# EAGLE design untitled (EAGLE 9.5.2)

## Sheet 1 of 3
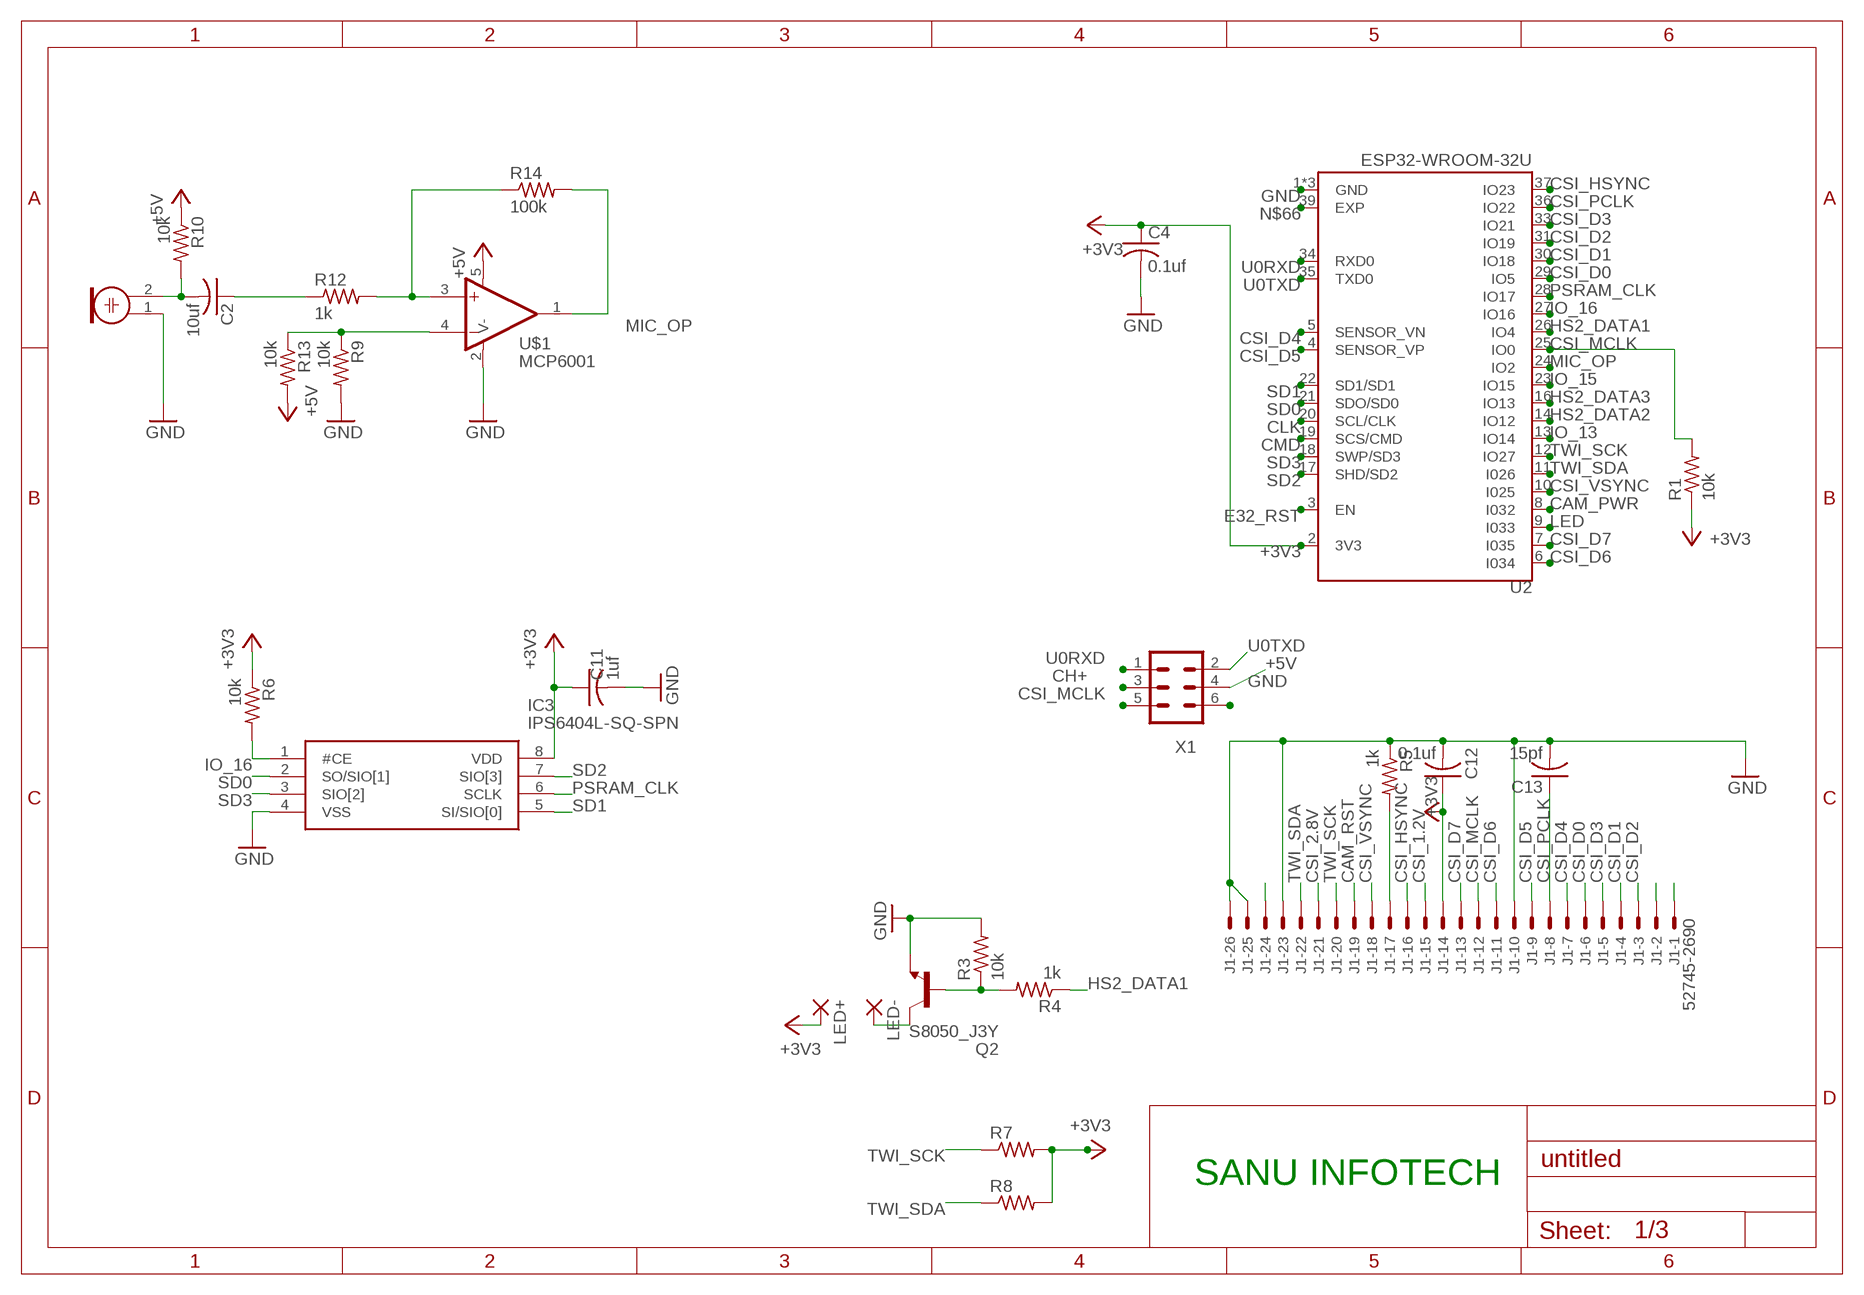
[diagram p0: schematic, sheet 1]

### Parts
C2  10uf  C-USC0805  [C0805]
C4  0.1uf  C-USC0805  [C0805]
C11  1uf  C-USC0805  [C0805]
C12  0.1uf  C-USC0805  [C0805]
C13  15pf  C-USC0805  [C0805]
IC3  IPS6404L-SQ-SPN  [SOIC127P600X175-8N]
J1  52745-2690  [52745-2690]
LED+  SMD2  [SMD1,27-2,54]
LED-  SMD2  [SMD1,27-2,54]
M1  ELECTRET_MICROPHON-F6035AP  [F6035AP]
Q2  S8050_J3Y  BCX70SMD  [SOT23]
R1  10k  R-US_R0805  [R0805]
R3  10k  R-US_R0805  [R0805]
R4  1k  R-US_R0805  [R0805]
R5  1k  R-US_R0805  [R0805]
R6  10k  R-US_R0805  [R0805]
R7  R-US_R0805  [R0805]
R8  R-US_R0805  [R0805]
R9  10k  R-US_R0805  [R0805]
R10  10k  R-US_R0805  [R0805]
R12  1k  R-US_R0805  [R0805]
R13  10k  R-US_R0805  [R0805]
R14  100k  R-US_R0805  [R0805]
U2  ESP32-WROOM-32U  [XCVR_ESP32-WROOM-32U]
U$1  MCP6001  [SOT23-5]
X1  MA03-2  [MA03-2]

### Nets
+3V3: C4.1 C11.1 C12.1 IC3.8(VDD) J1.14 LED+.1(P) R1.1 R6.1 R7.2 R8.2 U2.2(3V3) ; also sheet 3
+5V: R10.1 R13.2 U$1.5(V+) X1.4 ; also sheet 2,3
CAM_PWR: U2.8(I032) ; also sheet 3
CAM_RST: J1.19
CH+: X1.3 ; also sheet 3
CLK: U2.20(SCL/CLK)
CMD: U2.19(SCS/CMD)
CSI_1.2V: J1.15 ; also sheet 3
CSI_2.8V: J1.21 ; also sheet 3
CSI_D0: J1.6 U2.29(IO5)
CSI_D1: J1.4 U2.30(IO18)
CSI_D2: J1.3 U2.31(IO19)
CSI_D3: J1.5 U2.33(IO21)
CSI_D4: J1.7 U2.5(SENSOR_VN)
CSI_D5: J1.9 U2.4(SENSOR_VP)
CSI_D6: J1.11 U2.6(I034)
CSI_D7: J1.13 U2.7(I035)
CSI_HSYNC: J1.16 U2.37(IO23)
CSI_MCLK: J1.12 R1.2 U2.25(IO0) X1.5
CSI_PCLK: C13.1 J1.8 U2.36(IO22)
CSI_VSYNC: J1.18 U2.10(I025)
E32_RST: U2.3(EN)
GND: C4.2 C11.2 C12.2 C13.2 IC3.4(VSS) J1.10 J1.23 J1.25 J1.26 M1.1 Q2.2(E) R3.2 R5.1 R9.2 U2.1(GND) U2.15(GND) U2.38(GND) U$1.2(V-) X1.6 ; also sheet 2,3
HS2_DATA1: R4.1 U2.26(IO4)
HS2_DATA2: U2.14(IO12) ; also sheet 2
HS2_DATA3: U2.16(IO13) ; also sheet 2
IO_13: U2.13(IO14)
IO_15: U2.23(IO15)
IO_16: IC3.1(#CE) R6.2 U2.27(IO16)
LED: U2.9(I033)
MIC_OP: R14.2 U2.24(IO2) U$1.1(OUT)
N$6: J1.24
N$9: Q2.1(B) R3.1 R4.2
N$11: LED-.1(P) Q2.3(C)
N$13: J1.17 R5.2
N$23: C2.2 M1.2 R10.2
N$24: C2.1 R12.1
N$25: R12.2 R14.1 U$1.3(+IN)
N$27: R9.1 R13.1 U$1.4(-IN)
N$28: J1.2
N$29: J1.1
N$66: U2.39(EXP)
PSRAM_CLK: IC3.6(SCLK) U2.28(IO17)
SD0: IC3.2(SO/SIO[1]) U2.21(SDO/SD0)
SD1: IC3.5(SI/SIO[0]) U2.22(SD1/SD1)
SD2: IC3.7(SIO[3]) U2.17(SHD/SD2)
SD3: IC3.3(SIO[2]) U2.18(SWP/SD3)
TWI_SCK: J1.20 R7.1 U2.12(IO27)
TWI_SDA: J1.22 R8.1 U2.11(I026)
U0RXD: U2.34(RXD0) X1.1
U0TXD: U2.35(TXD0) X1.2

### Notes on the sheet
- SANU INFOTECH

## Sheet 2 of 3
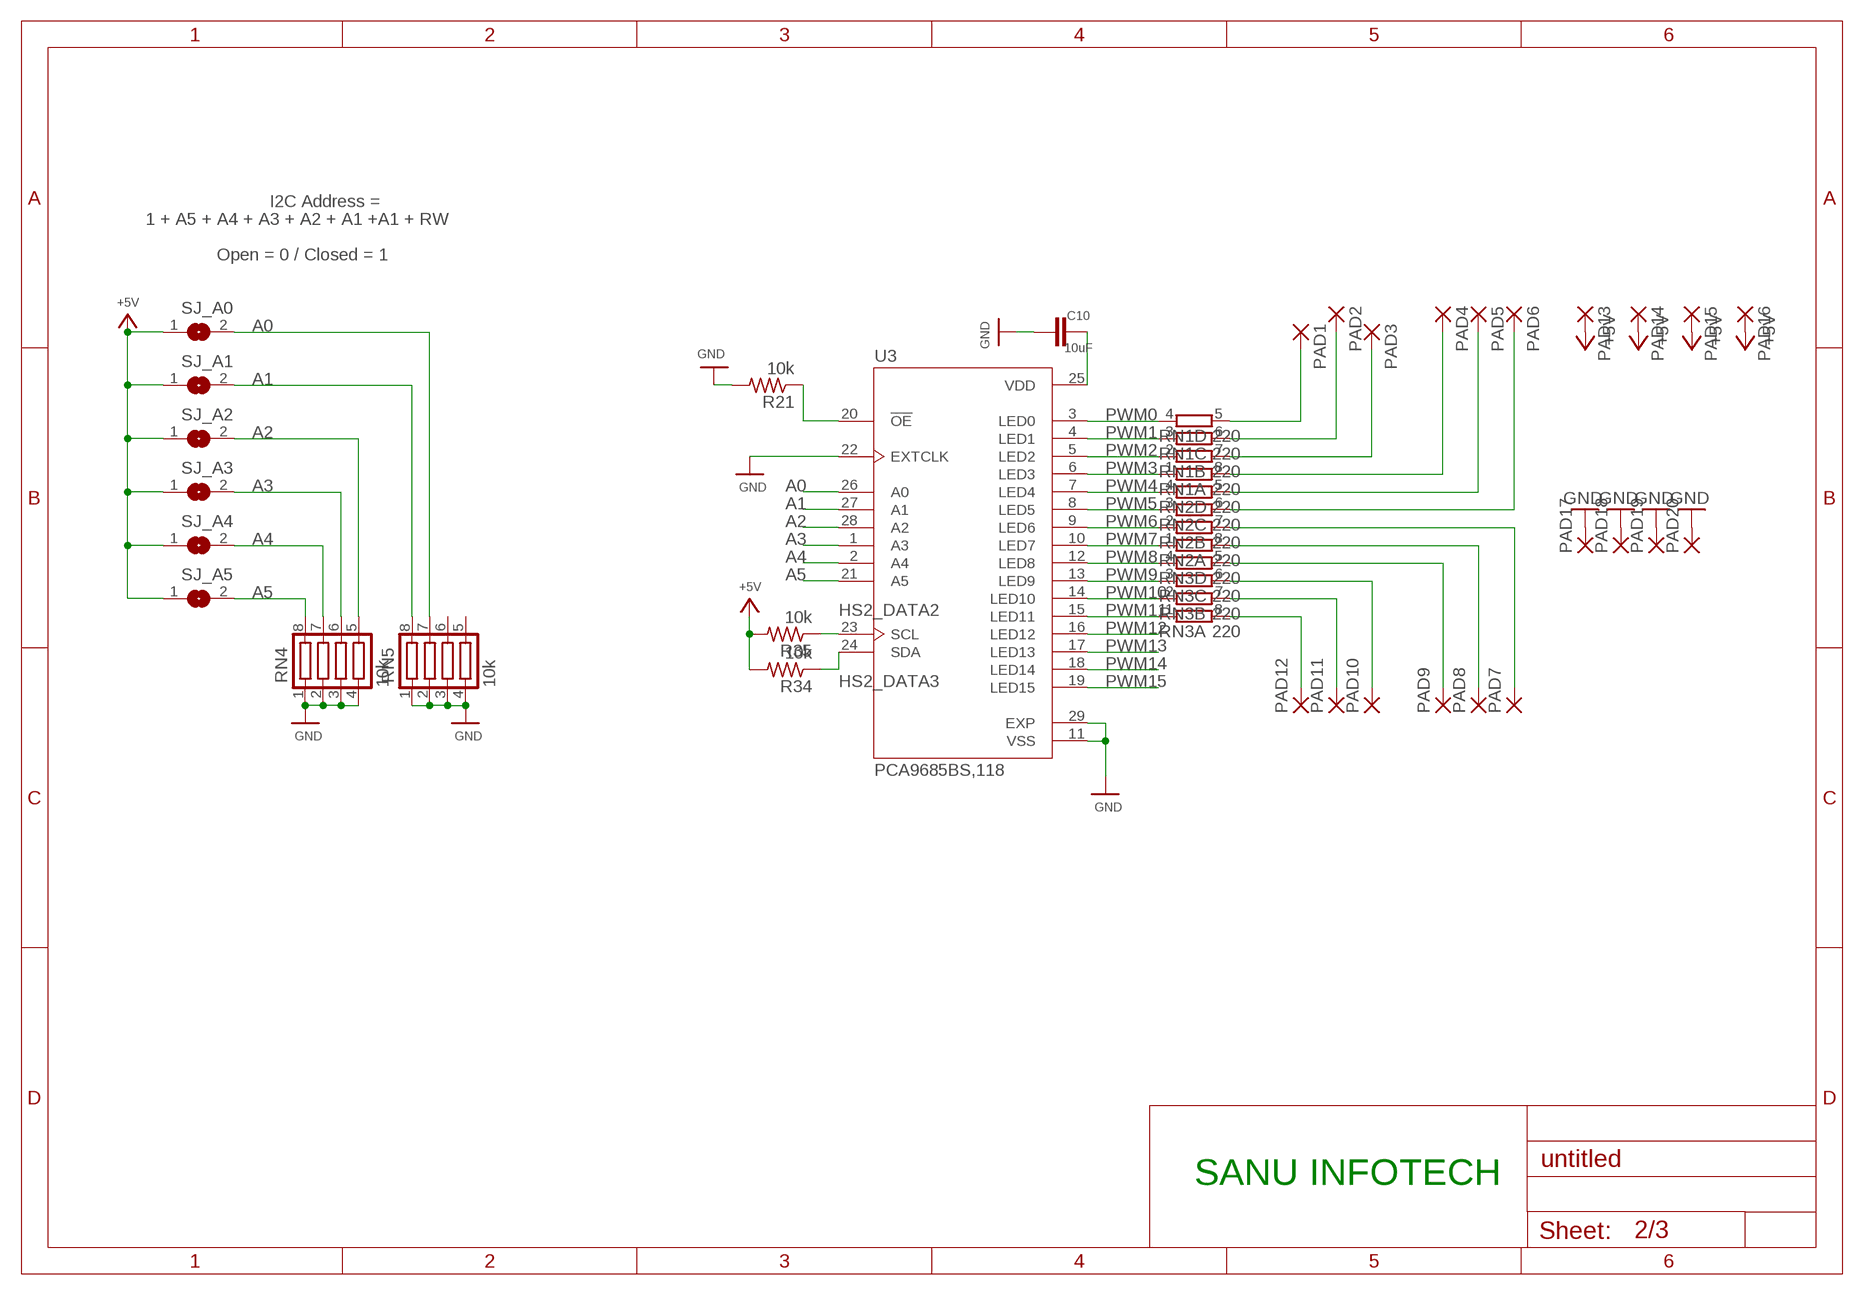
[diagram p1: schematic, sheet 2]

### Parts
C10  10uF  C-EUC0805  [C0805]
PAD1  1,6/0,8  [1,6/0,8]
PAD2  1,6/0,8  [1,6/0,8]
PAD3  1,6/0,8  [1,6/0,8]
PAD4  1,6/0,8  [1,6/0,8]
PAD5  1,6/0,8  [1,6/0,8]
PAD6  1,6/0,8  [1,6/0,8]
PAD7  1,6/0,8  [1,6/0,8]
PAD8  1,6/0,8  [1,6/0,8]
PAD9  1,6/0,8  [1,6/0,8]
PAD10  1,6/0,8  [1,6/0,8]
PAD11  1,6/0,8  [1,6/0,8]
PAD12  1,6/0,8  [1,6/0,8]
PAD13  1,6/0,8  [1,6/0,8]
PAD14  1,6/0,8  [1,6/0,8]
PAD15  1,6/0,8  [1,6/0,8]
PAD16  1,6/0,8  [1,6/0,8]
PAD17  1,6/0,8  [1,6/0,8]
PAD18  1,6/0,8  [1,6/0,8]
PAD19  1,6/0,8  [1,6/0,8]
PAD20  1,6/0,8  [1,6/0,8]
R21  10k  R-US_R0805  [R0805]
R34  10k  R-US_R0805  [R0805]
R35  10k  R-US_R0805  [R0805]
RN1  220  4R-N0603-ARV  [0603-ARV]
RN2  220  4R-N0603-ARV  [0603-ARV]
RN3  220  4R-N0603-ARV  [0603-ARV]
RN4  10k  CTS742C083  [CTS742C083]
RN5  10k  CTS742C083  [CTS742C083]
SJ_A0  SJ  [SJ]
SJ_A1  SJ  [SJ]
SJ_A2  SJ  [SJ]
SJ_A3  SJ  [SJ]
SJ_A4  SJ  [SJ]
SJ_A5  SJ  [SJ]
U3  PCA9685BS,118  [QFN65P600X600X100-29N]

### Nets
+5V: PAD13.1(P) PAD14.1(P) PAD15.1(P) PAD16.1(P) R34.2 R35.2 SJ_A0.1 SJ_A1.1 SJ_A2.1 SJ_A3.1 SJ_A4.1 SJ_A5.1 ; also sheet 1,3
A0: RN5.7 SJ_A0.2 U3.26(A0)
A1: RN5.8 SJ_A1.2 U3.27(A1)
A2: RN4.5 SJ_A2.2 U3.28(A2)
A3: RN4.6 SJ_A3.2 U3.1(A3)
A4: RN4.7 SJ_A4.2 U3.2(A4)
A5: RN4.8 SJ_A5.2 U3.21(A5)
GND: C10.2 PAD17.1(P) PAD18.1(P) PAD19.1(P) PAD20.1(P) R21.2 RN4.1 RN4.2 RN4.3 RN4.4 U3.11(VSS) U3.22(EXTCLK) U3.29(EXP) ; also sheet 1,3
HS2_DATA2: R35.1 U3.23(SCL) ; also sheet 1
HS2_DATA3: R34.1 U3.24(SDA) ; also sheet 1
N$1: PAD1.1(P) RN1.5
N$3: PAD2.1(P) RN1.6
N$5: PAD3.1(P) RN1.7
N$7: PAD4.1(P) RN1.8
N$10: PAD5.1(P) RN2.5
N$12: PAD6.1(P) RN2.6
N$14: PAD7.1(P) RN2.7
N$15: PAD8.1(P) RN2.8
N$16: PAD9.1(P) RN3.5
N$17: PAD10.1(P) RN3.6
N$18: PAD11.1(P) RN3.7
N$19: PAD12.1(P) RN3.8
N$21: RN5.1 RN5.2 RN5.3 RN5.4 ; supply symbol labelled GND
N$22: C10.1 U3.25(VDD)
OE: R21.1 U3.20(!OE)
PWM0: RN1.4 U3.3(LED0)
PWM1: RN1.3 U3.4(LED1)
PWM2: RN1.2 U3.5(LED2)
PWM3: RN1.1 U3.6(LED3)
PWM4: RN2.4 U3.7(LED4)
PWM5: RN2.3 U3.8(LED5)
PWM6: RN2.2 U3.9(LED6)
PWM7: RN2.1 U3.10(LED7)
PWM8: RN3.4 U3.12(LED8)
PWM9: RN3.3 U3.13(LED9)
PWM10: RN3.2 U3.14(LED10)
PWM11: RN3.1 U3.15(LED11)
PWM12: U3.16(LED12)
PWM13: U3.17(LED13)
PWM14: U3.18(LED14)
PWM15: U3.19(LED15)
Unconnected: RN5.5 RN5.6

### Notes on the sheet
- I2C Address =
- 1 + A5 + A4 + A3 + A2 + A1 +A1 + RW
- Open = 0 / Closed = 1
- SANU INFOTECH

## Sheet 3 of 3
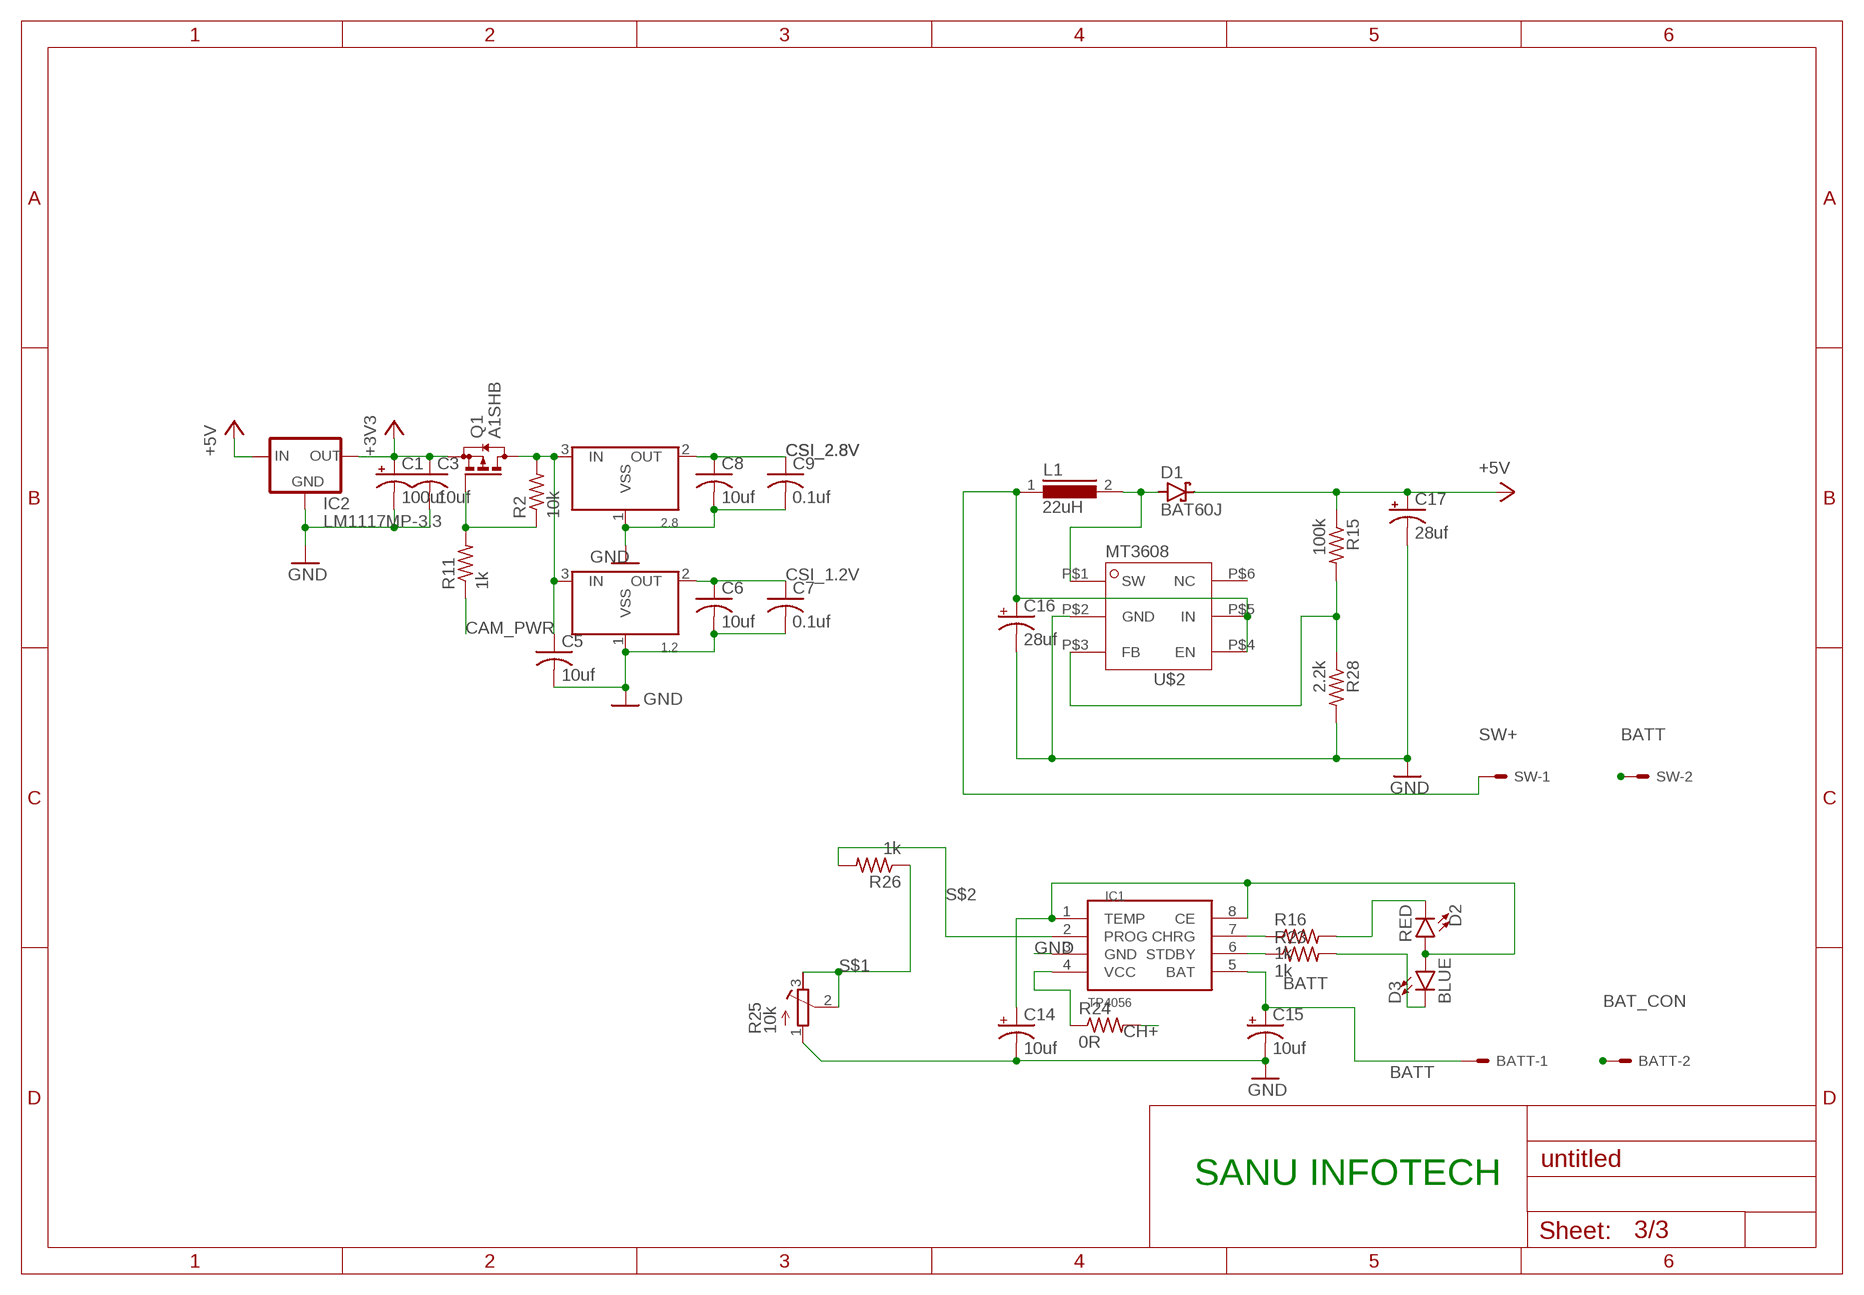
[diagram p2: schematic, sheet 3]

### Parts
1.2  XC6206SOT-23  [XC6206_SOT-23]
2.8  XC6206SOT-23  [XC6206_SOT-23]
BATT  332-02  [332-02]
C1  100uf  CPOL-USB/3528-21R  [B/3528-21R]
C3  10uf  C-USC0805  [C0805]
C5  10uf  C-USC0805  [C0805]
C6  10uf  C-USC0805  [C0805]
C7  0.1uf  C-USC0805  [C0805]
C8  10uf  C-USC0805  [C0805]
C9  0.1uf  C-USC0805  [C0805]
C14  10uf  CPOL-USB/3528-21W  [B/3528-21W]
C15  10uf  CPOL-USB/3528-21W  [B/3528-21W]
C16  28uf  CPOL-US153CLV-0405  [153CLV-0405]
C17  28uf  CPOL-US153CLV-0405  [153CLV-0405]
D1  BAT60J  [SOD323_ST]
D2  RED  LED-RED0603  [LED-0603]
D3  BLUE  LED-BLUE0603  [LED-0603]
IC1  TP4056  [SOP-8]
IC2  LM1117MP-3.3  [SOT223]
L1  22uH  DR74  [DR74]
Q1  A1SHB  BSS84  [SOT23]
R2  10k  R-US_R0805  [R0805]
R11  1k  R-US_R0805  [R0805]
R15  100k  R-US_M0805  [M0805]
R16  1k  R-US_M0805  [M0805]
R23  1k  R-US_M0805  [M0805]
R24  0R  R-US_M0805  [M0805]
R25  10k  R-TRIMM4G/J  [RTRIM4G/J]
R26  1k  R-US_M0805  [M0805]
R28  2.2k  R-US_M0805  [M0805]
SW  332-02  [332-02]
U$2  MT3608SOT23-6  [SOT23-6]

### Nets
+3V3: C1.+ C3.1 IC2.2(OUT) IC2.4(OUT) Q1.2(S) ; also sheet 1
+5V: C17.+ D1.C IC2.3(IN) R15.1 ; also sheet 1,2
BAT_CON: BATT.2
BATT: BATT.1 C15.+ IC1.5(BAT) SW.2
CAM_PWR: R11.1 ; also sheet 1
CH+: R24.2 ; also sheet 1
CSI_1.2V: 1.2.2(OUT) C6.1 C7.1 ; also sheet 1
CSI_2.8V: 2.8.2(OUT) C8.1 C9.1 ; also sheet 1
GND: 1.2.1(VSS) 2.8.1(VSS) C1.- C3.2 C5.2 C6.2 C7.2 C8.2 C9.2 C14.- C15.- C16.- C17.- IC1.3(GND) IC2.1(GND) R25.1(A) R28.2 U$2.P$2(GND) ; also sheet 1,2
N$2: 1.2.3(IN) 2.8.3(IN) C5.1 Q1.3(D) R2.2
N$8: Q1.1(G) R2.1 R11.2
N$20: C14.+ D2.A D3.A IC1.1(TEMP) IC1.8(CE)
N$26: R15.2 R28.1 U$2.P$3(FB)
N$31: D2.C R16.2
N$32: IC1.4(VCC) R24.1
N$33: IC1.6(STDBY) R23.1
N$34: IC1.7(CHRG) R16.1
N$35: D3.C R23.2
N$36: D1.A L1.2 U$2.P$1(SW)
S$1: R25.2(S) R25.3(E) R26.1
S$2: IC1.2(PROG) R26.2
SW+: C16.+ L1.1 SW.1 U$2.P$4(EN) U$2.P$5(IN)
Unconnected: U$2.P$6(NC)

### Notes on the sheet
- SANU INFOTECH

## Library data of the parts
1.2 2.8 = Voltage Regulator:XC6206: XC6206P , linear regulator. Producted by TOREX.Co Store Information: EXCEL device corporation http://www.excel-d.com/access/index.html
BATT SW = con-garry:332-02: 2 Pin - 2mm Dual Row Source: www.mpe-connector.de / garry_shortform_2012.pdf
C1 C14-C17 = rcl:CPOL-US: POLARIZED CAPACITOR, American symbol; SPICEPREFIX: C
C2-C9 C11-C13 = rcl:C-US: CAPACITOR, American symbol; SPICEPREFIX: C
C10 = rcl:C-EU: CAPACITOR, European symbol; SPICEPREFIX: C
D1 = diode:BAT60J: Schottky barrier diode Source: www.st.com, BAT60J.pdf
D2 = SparkFun-LED:LED-RED: Red SMD LED Used in manufacturing of most products at SparkFun Packages: 0603 - SMD 0603 package [Product Link] <http://docs.avagotech.com/docs/AV02-0551EN> 0603 SMART - SMD 0603 SMART package ( more efficient and expensive)[Product Link] <http://www.osram-os.com/Graphics/XPic2/00077099_0.pdf> 1206 - SMD1206 package [Product Link] <https://www.sparkfun.com/datasheets/DevTools/LilyPad/Q150OVS4.pdff> SparkFun Products: Pro Mini 328 -5V <https://www.sparkfun.com/products/821> RedBoard <https://www.sparkfun.com/products/12757> IOIO-OTG <https://www.sparkfun.com/products/13613>; PROD_ID: DIO-00819
D3 = SparkFun-LED:LED-BLUE: Blue SMD LED Used in manufacturing of various products at SparkFun Packages: 0603 - SMD 0603 package [Product Link] <http://www.digikey.com/product-detail/en/SMLE12BC7TT86/511-1589-2-ND/1641808> 1206 - SMD1206 package [Product Link] <http://www.digikey.com/product-detail/en/lite-on-inc/LTST-C150TBKT/160-1643-1-ND/573584> SparkFun Products: ESP8266 Thing-Dev Board <https://www.sparkfun.com/products/13711> RedBoard <https://www.sparkfun.com/products/12757>; PROD_ID: DIO-08575
IC1 = TP4056:TP4056
IC2 = lm1117_10:LM1117?-*: 800mA Low-Dropout Linear Regulator Source: http://www.ti.com/lit/ds/symlink/lm1117-n.pdf; MF: Texas Instruments; MPN: LM1117MP-3.3; OC_FARNELL: 9778195; OC_NEWARK: 28X3416
IC3 = IPS6404L-SQ-SPN:IPS6404L-SQ-SPN: int Source: Datasheet <https://github.com/Edragon/Datasheet/blob/master/IPUS/IPUS 64Mbit.pdf>; DESCRIPTION: int; HEIGHT: 1.75mm; MANUFACTURER_NAME: Electrodragon; MANUFACTURER_PART_NUMBER: IPS6404L-SQ-SPN
J1 = con-molex:52745-2690: FFC/FPC-to-Board 0.50mm (.020") SMT Top Contact Right Angle, ZIF, Style Receptacle 52745 / 52435 Source: http://www.molex.com/product/ffc/52745.html; MF: MOLEX; OC_FARNELL: unknown; OC_NEWARK: unknown
L1 = inductors:DR74: High Power Density, High Efficiency, Shielded Inductors Source: coiltronics_dr_series.pdf; SPICEPREFIX: L
LED+ LED- = wirepad:SMD2: SMD PAD
M1 = microphon:ELECTRET_MICROPHON-: Electret Condenser Microphone
PAD1-PAD20 = wirepad:1,6/0,8: THROUGH-HOLE PAD
Q1 = transistor-small-signal:BSS84: P-CHANNEL MOS FET
Q2 = transistor-npn:BCX70*: NPN Transistor
R1-R16 R21 R23 R24 R26 R28 R34 R35 = rcl:R-US_: RESISTOR, American symbol; SPICEPREFIX: R
R25 = rcl:R-TRIMM: Trimm resistor; SPICEMODEL: X; SPICEPREFIXL: POT
RN1-RN3 = resistor-dil:4R-N: Array Chip Resistor Source: RS Component / Phycomp; OC_FARNELL: unknown; OC_NEWARK: unknown
RN4 RN5 = resistor-net:CTS742C083: Chip Resistor Array 4 Single Resistor Source: http://www.ctscorp.com/components/Datasheets/CTSChipArrayDs.pdf; OC_FARNELL: unknown; OC_NEWARK: unknown
SJ_A0 SJ_A1-SJ_A5 = jumper:SJ: SMD solder JUMPER
U2 = ESP32-WROOM-32U:ESP32-WROOM-32U: Wi-Fi/BT BLE Module ESP32-D0WD SPI Flash UART U.FL Conn.; AVAILABILITY: Unavailable; DESCRIPTION: Bluetooth, WiFi 802.11b/g/n, Bluetooth v4.2 + EDR, Class 1, 2 and 3 Transceiver Module 2.4GHz ~ 2.5GHz Antenna Not Included, U.FL Surface Mount; MF: Espressif Systems; MP: ESP32-WROOM-32U; PACKAGE: Module Espressif Systems; PRICE: None
U3 = PCA9685BS_118:PCA9685BS,118: PCA9685 - 16-channel, 12-bit PWM Fm+ I2C-bus LED controller; AVAILABILITY: Unavailable; DESCRIPTION: LED Driver IC 16 Output Linear PWM Dimming 25mA 28-HVQFN _6x6_; MF: NXP USA; MP: PCA9685BS,118; PACKAGE: HVQFN-28 NXP Semiconductors; PRICE: None
U$1 = MCP6001:MCP6001: General Op Amp 1.8V min supply 1MHz (6V/us); AVAILABILITY: Unavailable; DESCRIPTION: General Purpose Amplifier 1 Circuit Rail-to-Rail SOT-23-5; MF: Universal Power Group; MP: MCP 6001; PACKAGE: SOT-753 Universal Power Group; PRICE: None
U$2 = MT3608:MT3608: MT3608 High Efficiency 1.2MHz 2A Step Up Converter BY: Rangana Tennakoon
X1 = con-lstb:MA03-2: PIN HEADER; OC_FARNELL: unknown; OC_NEWARK: unknown

## Net classes
0 default: width 0.203 mm

## Board
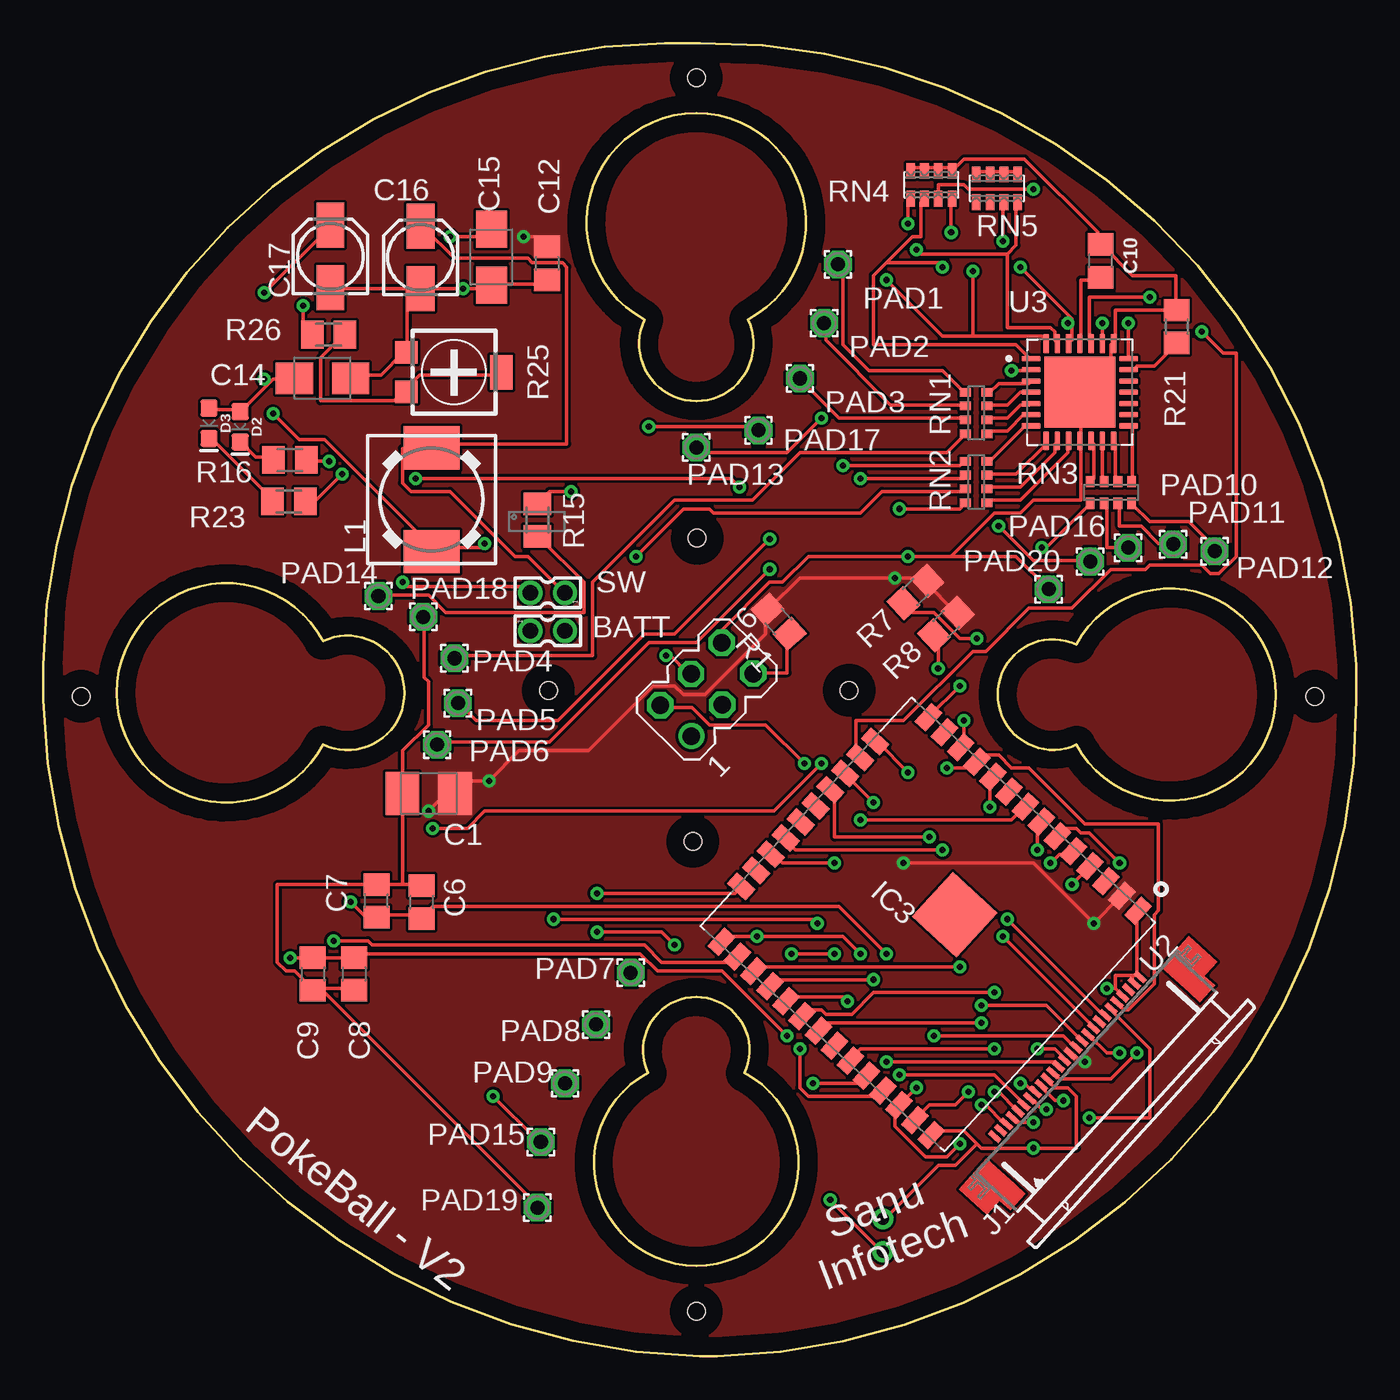
[diagram p3: board, top side]
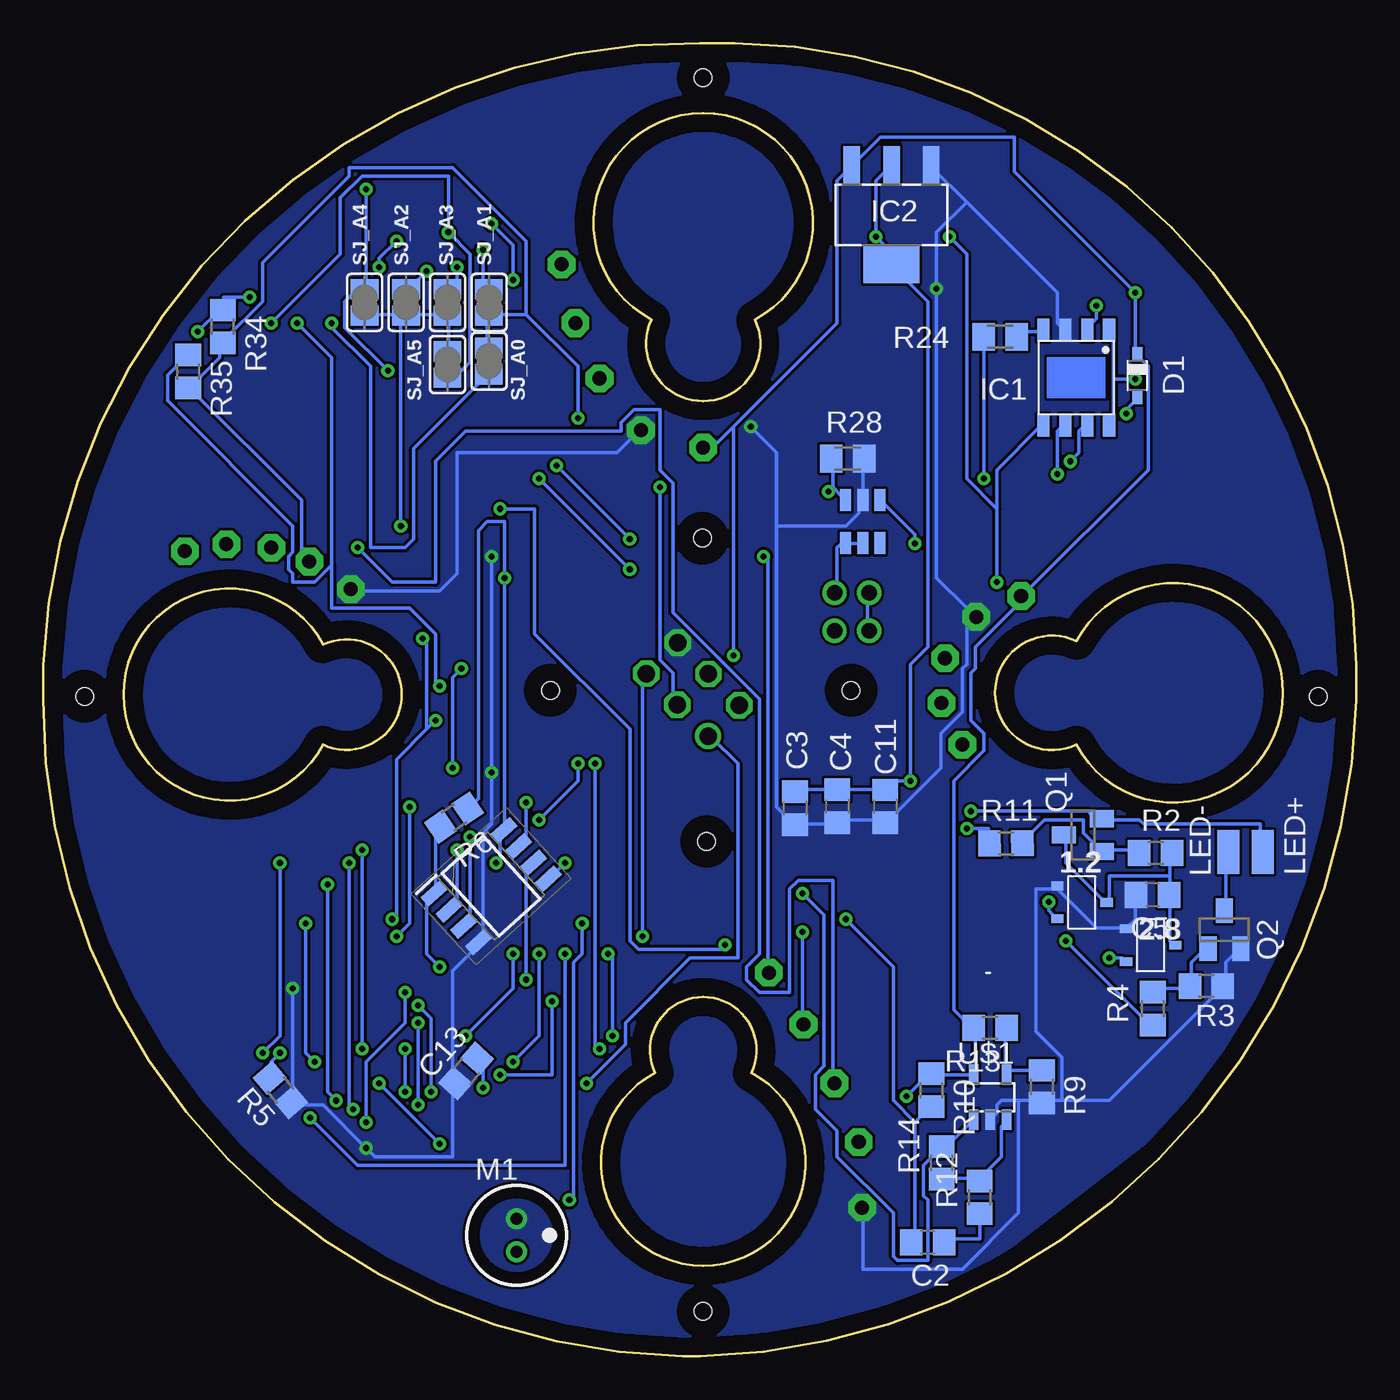
[diagram p4: board, bottom side, seen from below]

Size 76 x 76 mm. Coordinates in mm from the lower left corner, seen from the top.
Outline: 0,40 arc-88 36,76 38,76 arc-88 76,40 76,38 arc-89 39,0 38,0 arc-87 0,38 0,40
Outline: 16.2,35.4 arc-304 16.2,41.4 arc-230 16.2,35.4
Outline: 34.8,60 arc-304 40.8,60 arc-230 34.8,60
Outline: 59.8,41.2 arc-304 59.8,35.4 arc-230 59.8,41.2
Outline: 40.6,16.4 arc-304 35,16.4 arc-230 40.6,16.4
Copper layers (1*16): Top 0.035mm / dielectric 1.5mm / Bottom 0.035mm
Design rules "default": minimum track width 6mil, minimum drill 0.35mm, track to track 6mil, track to pad 6mil, pad to pad 6mil, via to via 6mil, smd to smd 6mil, copper to edge 40mil, drill to drill 6mil, minimum pad ring 10mil, minimum via ring 8mil, stop-mask expansion 4mil, vias tented up to drill 0mil, thermal gap 10mil
Holes 1 mm at 2.2,38.2 73.6,38.2 37.8,74 37.8,2.6 29.25,38.55 46.65,38.55 37.85,47.35 37.6,29.8

### Footprints (pad centres in the part's own frame; a part is rotated, then mirrored left to right if it is on the bottom)
XC6206_SOT-23 = smd 0.5 x 0.7: 1 -0.95,-1.415; 2 0.95,-1.415; 3 0,1.44
332-02 = drill 0.9 pad 1.27: 1 0,-1; 2 0,1
B/3528-21R = smd 1.95 x 2.5: + 1.525,0; - -1.525,0
C0805 = smd 1.3 x 1.5: 1 -0.95,0; 2 0.95,0
B/3528-21W = smd 2.15 x 1.8: + 1.625,0; - -1.625,0
153CLV-0405 = smd 2.6 x 1.6: + 1.8,0; - -1.8,0
SOD323_ST = smd 0.8 x 0.6: A 1.25,0; C -1.25,0
LED-0603 = smd 1 x 1: A -0.877,0; C 0.877,0
SOP-8 = smd 1.3 x 0.7: 1 -2.75,1.905; 2 -2.75,0.635; 3 -2.75,-0.635; 4 -2.75,-1.905; 5 2.75,-1.905; 6 2.75,-0.635; 7 2.75,0.635; 8 2.75,1.905
SOT223 = smd 0.95 x 2.15: 1 -2.3,-2.9; 2 0,-2.9; 3 2.3,-2.9 | smd 3.25 x 2.15: 4 0,2.9
SOIC127P600X175-8N = smd 1.525 x 0.7: 1 -2.712,1.905; 2 -2.712,0.635; 3 -2.712,-0.635; 4 -2.712,-1.905; 5 2.712,-1.905; 6 2.712,-0.635; 7 2.712,0.635; 8 2.712,1.905
52745-2690 = smd 0.3 x 0.8: 1 -6.25,2.5; 2 -5.75,2.5; 3 -5.25,2.5; 4 -4.75,2.5; 5 -4.25,2.5; 6 -3.75,2.5; 7 -3.25,2.5; 8 -2.75,2.5; 9 -2.25,2.5; 10 -1.75,2.5; 11 -1.25,2.5; 12 -0.75,2.5; 13 -0.25,2.5; 14 0.25,2.5; 15 0.75,2.5; 16 1.25,2.5; 17 1.75,2.5; 18 2.25,2.5; 19 2.75,2.5; 20 3.25,2.5; 21 3.75,2.5; 22 4.25,2.5; 23 4.75,2.5; 24 5.25,2.5; 25 5.75,2.5; 26 6.25,2.5
DR74 = smd 2.5 x 3.25: 1 -3,0; 2 3,0
SMD1,27-2,54 = smd 1.27 x 2.54: 1 0,0
F6035AP = drill 0.7 pad 1.2: 1 0,0.95; 2 0,-0.95
1,6/0,8 = drill 0.813 pad 1.6 octagon: 1 0,0
SOT23 = smd 1 x 1.4: 1 -0.95,-1.1; 2 0.95,-1.1; 3 0,1.1
R0805 = smd 1.3 x 1.5: 1 -0.95,0; 2 0.95,0
M0805 = smd 1.3 x 1.6: 1 -0.95,0; 2 0.95,0
RTRIM4G/J = smd 1.3 x 1.3: 1 -1.15,-2.75; 3 1.15,-2.75 | smd 2 x 1.3: 2 0,2.75
0603-ARV = smd 0.5 x 0.65: 1 -1.2,-0.625; 2 -0.4,-0.625; 3 0.4,-0.625; 4 1.2,-0.625; 5 1.2,0.625; 6 0.4,0.625; 7 -0.4,0.625; 8 -1.2,0.625
CTS742C083 = smd 0.5 x 0.9: 1 -1.2,-0.8; 2 -0.4,-0.8; 3 0.4,-0.8; 4 1.2,-0.8; 5 1.2,0.8; 6 0.4,0.8; 7 -0.4,0.8; 8 -1.2,0.8
SJ = smd 1.168 x 1.6: 1 -0.762,0; 2 0.762,0
XCVR_ESP32-WROOM-32U = smd 1.45 x 0.86: 1 -8.83,8.41; 2 -8.83,7.14; 3 -8.83,5.87; 4 -8.83,4.6; 5 -8.83,3.33; 6 -8.83,2.06; 7 -8.83,0.79; 8 -8.83,-0.48; 9 -8.83,-1.75; 10 -8.83,-3.02; 11 -8.83,-4.29; 12 -8.83,-5.56; 13 -8.83,-6.83; 14 -8.83,-8.1; 25 8.83,-8.1; 26 8.83,-6.83; 27 8.83,-5.56; 28 8.83,-4.29; 29 8.83,-3.02; 30 8.83,-1.75; 31 8.83,-0.48; 32 8.83,0.79; 33 8.83,2.06; 34 8.83,3.33; 35 8.83,4.6; 36 8.83,5.87; 37 8.83,7.14; 38 8.83,8.41 | smd 0.86 x 1.45: 15 -5.715,-9.43; 16 -4.445,-9.43; 17 -3.175,-9.43; 18 -1.905,-9.43; 19 -0.635,-9.43; 20 0.635,-9.43; 21 1.905,-9.43; 22 3.175,-9.43; 23 4.445,-9.43; 24 5.715,-9.43 | smd 3.5 x 3.5: 39 -1.46,0.77
QFN65P600X600X100-29N = smd 1.1 x 0.32: 1 -2.815,1.95; 2 -2.815,1.3; 3 -2.815,0.65; 4 -2.815,0; 5 -2.815,-0.65; 6 -2.815,-1.3; 7 -2.815,-1.95; 15 2.815,-1.95; 16 2.815,-1.3; 17 2.815,-0.65; 18 2.815,0; 19 2.815,0.65; 20 2.815,1.3; 21 2.815,1.95 | smd 0.32 x 1.1: 8 -1.95,-2.815; 9 -1.3,-2.815; 10 -0.65,-2.815; 11 0,-2.815; 12 0.65,-2.815; 13 1.3,-2.815; 14 1.95,-2.815; 22 1.95,2.815; 23 1.3,2.815; 24 0.65,2.815; 25 0,2.815; 26 -0.65,2.815; 27 -1.3,2.815; 28 -1.95,2.815 | smd 4.1 x 4.1: 29 0,0
SOT23-5 = smd 0.55 x 1.2: 1 -0.95,-1.3; 2 0,-1.3; 3 0.95,-1.3; 4 0.95,1.3; 5 -0.95,1.3
SOT23-6 = smd 1.27 x 0.635: P$1 0,0; P$2 0,-1; P$3 0,-2; P$4 2.5,-2; P$5 2.5,-1; P$6 2.5,0
MA03-2 = drill 1.016: 1 -2.54,-1.27 | drill 1.016 octagon: 2 -2.54,1.27; 3 0,-1.27; 4 0,1.27; 5 2.54,-1.27; 6 2.54,1.27

### Placement (x,y rotation side)
1.2  15.89,26.27 270 bottom
2.8  11.91,23.79 270 bottom
BATT  29.2,42 270 top
C1  22.32,32.58 0 top
C2  24.8,6.6 180 bottom
C3  32.49,31.73 270 bottom
C4  30.04,31.83 270 bottom
C5  11.79,26.71 180 bottom
C6  21.91,26.29 90 top
C7  19.29,26.36 90 top
C8  17.99,22.14 270 top
C9  15.61,22.13 270 top
C10  61.2,63.4 90 top
C11  27.27,31.83 270 bottom
C12  29.16,63.26 270 top
C13  51.51,16.52 228.5 bottom
C14  16.17,56.6 180 top
C15  25.95,63.62 90 top
C16  21.84,63.6 90 top
C17  16.62,63.66 90 top
D1  12.67,56.76 270 bottom
D2  11.4,53.8 270 top
D3  9.6,54 270 top
IC1  16.21,56.64 270 bottom
IC2  26.9,66.07 180 bottom
IC3  50.07,27.21 42.3 bottom
J1  61.13,15.65 47.7 top
L1  22.47,49.58 270 top
LED+  5.4,29.2 180 bottom
LED-  7.4,29.2 0 bottom
M1  48.6,7 0 bottom
PAD1  46,63.2 0 top
PAD2  45.2,59.8 0 top
PAD3  43.8,56.6 0 top
PAD4  23.8,40.4 0 top
PAD5  24,37.8 0 top
PAD6  22.8,35.4 0 top
PAD7  34,22.2 0 top
PAD8  32,19.2 0 top
PAD9  30.2,15.8 0 top
PAD10  62.8,46.8 0 top
PAD11  65.4,47 0 top
PAD12  67.8,46.6 0 top
PAD13  37.8,52.6 0 top
PAD14  19.4,44 0 top
PAD15  28.8,12.4 0 top
PAD16  60.6,46 0 top
PAD17  41.4,53.6 0 top
PAD18  22,42.8 0 top
PAD19  28.6,8.6 0 top
PAD20  58.2,44.4 0 top
Q1  15.83,30.17 90 bottom
Q2  7.64,24.69 0 bottom
R1  42.56,42.53 312.2 top
R2  11.61,29.12 0 bottom
R3  8.68,21.43 0 bottom
R4  11.78,20.12 90 bottom
R5  62.27,15.41 131.1 bottom
R6  52.22,31.18 214.1 bottom
R7  50.48,44.23 42.8 top
R8  52.25,42.38 43.5 top
R9  18.2,15.6 270 bottom
R10  24.6,15.4 270 bottom
R11  20.28,29.69 0.6 bottom
R12  21.8,9.2 90 bottom
R13  21.2,19 180 bottom
R14  24,11.2 90 bottom
R15  28.6,48.4 90 top
R16  14.28,51.88 180 top
R21  65.6,59.6 90 top
R23  14.22,49.48 180 top
R24  20.61,59.01 180 bottom
R25  23.77,56.96 270 top
R26  16.52,59.13 180 top
R28  29.43,51.96 0 bottom
R34  65.6,59.6 270 bottom
R35  67.6,57 270 bottom
RN1  54,54.6 90 top
RN2  54,50.6 90 top
RN3  61.8,50 180 top
RN4  51.4,67.8 180 top
RN5  55.2,67.6 180 top
SJ_A0  50.2,57.6 270 bottom
SJ_A1  50.2,61 90 bottom
SJ_A2  55,61 90 bottom
SJ_A3  52.6,61 90 bottom
SJ_A4  57.4,61 90 bottom
SJ_A5  52.6,57.4 270 bottom
SW  29.2,44.2 90 top
U2  51.2,25 227.3 top
U3  60,55.8 0 top
U$1  21.2,15 0 bottom
U$2  27.56,49.57 270 bottom
X1  38.4,38.6 45.4 top

### Tracks (layer width: path | path; a pad name or v marks a point on that pad's centre or on a via)
+3V3  (via drill 0.35)
  Top 0.203: v60.3,17.05 60.05,17.05 59.8,17.3 59.55,17.3 J1.14 | U2.2 62.3,26.55 v60.8,25.05 57.3,28.55 v49.8,28.55 | v27.8,64.8 28.55,64.8 29.05,64.3 C12.1 | R8.2 52.8,43.05 51.05,44.8 R7.2 51.05,45.05 v49.3,45.05 43.8,45.05 42.05,43.3 R1.1 41.8,43.05 41.8,41.8 38.3,38.3 37.05,38.3 36.55,38.8 35.3,38.8 31.55,35.05 27.55,35.05 v25.8,33.3 24.55,33.3 24.05,32.8 C1.+ 23.8,32.55 23.3,32.55 v22.3,31.55
  Bottom 0.203: v60.3,17.05 60.8,17.55 v60.8,25.05 | R6.1 51.3,31.8 50.8,32.3 50.8,47.8 50.3,48.3 49.3,48.3 v49.3,45.05 49.3,30.55 IC3.8 49.55,30.3 49.55,28.8 v49.8,28.55 | LED+.1 5.55,29.3 5.55,30.8 12.3,30.8 12.55,31.05 14.55,31.05 Q1.2 14.8,31.3 15.3,31.3 15.55,31.55 v22.3,31.55 | IC2.2 27.05,68.8 27.8,68.05 v27.8,64.8 27.05,64.05 27.05,63.3 IC2.4 26.8,63.05 24.8,61.05 24.8,41.05 25.8,40.05 v25.8,33.3 27.05,33.3 27.05,32.8 C11.1 27.3,32.8 29.8,32.8 C4.1 30.05,32.8 32.3,32.8 C3.1
  pour Top (no thermals): 5.2,57.2 4,55 3,52.6 2.4,50.8 1.6,48.2 1,45.4 0.8,43.2 0.6,40.4 0.6,35.8 1,33.4 1.4,30.8 2,28 3,25.2 4.4,22 6.2,19 8.2,16 10,13.6 12.8,10.6 15.2,8.8 18,6.8 21.2,4.8 24.4,3.4 27.8,2.2 31.6,1.2 36,0.4 39.8,0.4 44,1 47.6,1.8 52.2,3.4 56,5 60.6,7.8 64.4,11 67.2,14.2 69.4,17.4 71.2,20.2 73,24.2 74.4,28.6 75.6,35.4 75.6,38.4 75.2,43.8 73.8,49.6 71,56.2 66.6,62.8 64,65.6 59.2,69.4 55.6,71.6 51.8,73 46.6,74.8 42.6,75.2 39.8,75.6 36.8,75.6 33,75.4 29.6,74.8 26.4,74 23.4,73 20.4,71.6 17.2,69.8 14.8,68.2 12.4,66.2 10.4,64 8.8,62.4 7.4,60.2 5.6,57.8
+5V  (via drill 0.35)
  Top 0.203: v55.3,48.05 57.3,46.05 60.55,46.05 PAD16.1 | v36.05,40.55 36.3,40.55 37.3,39.55 X1.4 | v26.05,15.05 28.55,12.55 28.8,12.55 PAD15.1 | R15.1 28.8,47.3 31.3,44.8 31.3,43.05 23.3,43.05 22.3,44.05 19.55,44.05 PAD14.1 | v12.8,61.55 16.55,65.3 C17.+ | v45.05,54.3 43.05,52.3 38.05,52.3 37.8,52.55 PAD13.1
  Bottom 0.203: SJ_A5.1 52.55,58.3 52.55,60.05 SJ_A3.1 52.8,60.3 54.8,60.3 SJ_A2.1 | SJ_A4.1 57.3,60.3 55.05,60.3 SJ_A2.1 | SJ_A0.1 50.3,58.55 50.3,60.05 SJ_A1.1 50.05,60.3 48.05,60.3 | 67.55,56.05 65.8,57.8 65.8,58.55 R34.2 65.55,58.8 63.3,61.05 63.3,63.3 58.3,68.3 58.3,68.8 52.3,68.8 48.05,64.55 48.05,60.3 | 67.55,56.05 61.05,49.55 61.05,46.3 60.8,46.05 PAD16.1 | 67.55,56.05 R35.2 | v55.3,48.05 55.3,59.8 55.05,60.05 SJ_A2.1 | 36.05,53.8 37.05,52.8 37.8,52.8 PAD13.1 | 36.05,53.8 30.05,59.8 30.05,68.05 29.3,68.8 IC2.3 29.05,69.05 27.55,70.55 19.8,70.55 19.8,68.55 v12.8,61.55 12.8,58.05 D1.C 12.55,57.8 12.05,57.3 12.05,51.3 19.3,44.05 PAD14.1 19.55,43.8 19.55,43.55 22.05,41.05 22.05,39.8 22.3,39.55 22.3,36.8 21.55,36.05 21.55,35.05 23.3,33.3 23.3,20.05 22.3,19.05 R13.2 22.05,18.8 22.05,16.55 U$1.5 22.3,16.3 24.55,16.3 R10.1 24.8,16.3 v26.05,15.05 | 36.05,53.8 v36.05,40.55 | 48.05,60.3 45.05,57.3 v45.05,54.3
A0  (via drill 0.35)
  Top 0.203: v55.55,64.55 55.55,66.8 RN5.7 | v56.55,63.05 59.55,60.05 59.55,59.8 | 59.55,59.8 59.55,58.8 59.3,58.8 U3.26 | 59.55,59.8 v59.3,59.8
  Bottom 0.203: v55.55,64.55 56.55,63.55 v56.55,63.05 | v59.3,59.8 59.3,59.55 57.05,57.3 57.05,46.8 55.05,46.8 54.55,47.3 54.55,52.55 50.3,56.8 SJ_A0.2
A1  (via drill 0.35)
  Top 0.203: 55.8,63.8 56.3,64.3 56.3,66.8 RN5.8 | 55.8,63.8 55.8,59.55 58.3,59.55 58.55,59.3 58.55,58.8 U3.27 | v50.55,64.05 50.8,63.8 55.8,63.8
  Bottom 0.203: v50.55,64.05 50.55,62.05 50.3,61.8 SJ_A1.2
A2  (via drill 0.35)
  Top 0.203: v50.05,65.55 50.05,66.8 RN4.5 | v48.8,62.3 52.05,59.05 53.8,59.05 | 53.8,59.05 57.8,59.05 58.05,58.8 U3.28 | 53.8,59.05 v53.8,62.8
  Bottom 0.203: v50.05,65.55 48.8,64.3 v48.8,62.3 | v53.8,62.8 54.8,61.8 SJ_A2.2
A3  (via drill 0.35)
  Top 0.203: 48.8,63.3 48.05,62.55 48.05,58.55 56.3,58.55 57.05,57.8 U3.1 | 48.8,63.3 50.3,64.8 50.8,64.8 50.8,66.8 RN4.6 | v52.05,63.05 51.8,63.3 48.8,63.3
  Bottom 0.203: v52.05,63.05 52.05,62.3 52.55,61.8 SJ_A3.2
A4  (via drill 0.35)
  Top 0.203: RN4.7 51.8,67.8 53.3,67.8 53.55,67.55 v57.3,67.55 | v56.05,57.05 57.05,57.05 U3.2
  Bottom 0.203: 57.3,62.3 57.3,61.8 SJ_A4.2 57.3,62.3 | 57.3,62.3 v57.3,67.55 | v56.05,57.05 58.55,59.55 58.55,61.05 57.3,62.3
A5  (via drill 0.35)
  Top 0.203: v52.55,65.05 52.55,66.8 RN4.8 | v62.8,59.8 62.8,57.8 U3.21
  Bottom 0.203: SJ_A5.2 52.55,56.8 52.05,56.8 51.3,57.55 51.3,63.8 v52.55,65.05 52.55,68.3 57.55,68.3 58.8,67.05 58.8,63.8 v62.8,59.8
BATT  (via drill 0.35)
  Top 0.203: v20.8,44.8 21.05,44.55 27.8,44.55 28.05,44.3 SW.2 | v23.55,64.8 25.55,64.8 25.8,65.05 C15.+
  Bottom 0.203: v20.8,44.8 20.8,49.05 | 20.8,49.05 20.8,51.3 18.3,53.8 IC1.5 | v23.55,64.8 22.55,63.8 22.55,50.8 20.8,49.05 | BATT.1 28.3,42.05 28.3,44.05 SW.2
CAM_PWR  (via drill 0.35)
  Top 0.203: v47.3,31.05 56.05,31.05 56.8,31.8 U2.8 | v45.05,34.3 42.3,31.55 25.55,31.55 24.55,30.55 v22.55,30.55
  Bottom 0.203: v47.3,31.05 45.05,33.3 v45.05,34.3 | v22.55,30.55 21.3,30.55 21.3,29.8 R11.1
CH+  (via drill 0.35)
  Top 0.203: v21.55,50.8 39.8,50.8 v40.3,50.3
  Bottom 0.203: v21.55,50.8 21.55,58.8 R24.2 | v40.3,50.3 40.3,40.3 39.55,39.55 39.55,37.8 X1.3
CSI_1.2V  (via drill 0.35)
  Top 0.203: v17.8,26.3 18.55,25.55 19.05,25.55 C7.1 19.3,25.55 21.8,25.55 C6.1 22.05,25.55 22.55,26.05 46.05,26.05 v48.8,23.3 | v51.55,18.55 59.05,18.55 59.55,18.05 J1.15
  Bottom 0.203: v17.8,26.3 17.8,25.8 17.55,25.55 1.2.2 | v51.55,18.55 48.8,21.3 v48.8,23.3
CSI_2.8V  (via drill 0.35)
  Top 0.203: v14.3,23.05 15.55,23.05 C9.1 15.8,23.05 17.8,23.05 C8.1 18.05,23.3 34.55,23.3 35.55,22.3 39.3,22.3 v43.05,18.55 | v60.55,13.8 64.05,13.8 64.05,17.8 61.8,20.05 J1.21 | v43.3,23.3 v45.8,23.3
  Bottom 0.203: v14.3,23.05 13.55,23.05 2.8.2 | v60.55,13.8 57.8,11.05 45.8,11.05 v45.8,23.3 | v43.3,23.3 43.05,23.05 v43.05,18.55
CSI_D0  (via drill 0.35)
  Top 0.203: v49.55,16.3 55.05,16.3 56.55,14.8 J1.6 | v46.55,20.55 46.3,20.8 43.05,20.8 U2.29
  Bottom 0.203: v49.55,16.3 46.55,16.3 v46.55,20.55
CSI_D1  (via drill 0.35)
  Top 0.203: v57.3,13.55 56.3,13.55 56.05,13.8 J1.4 | v55.05,21.05 48.05,21.05 46.8,19.8 45.3,19.8 45.05,20.05 44.3,20.05 44.05,19.8 U2.30
  Bottom 0.203: v57.3,13.55 57.3,17.05 55.05,19.3 v55.05,21.05
CSI_D2  (via drill 0.35)
  Top 0.203: v54.3,14.55 54.55,14.55 55.55,13.55 J1.3 | v54.3,19.3 45.3,19.3 45.05,19.05 U2.31
  Bottom 0.203: v54.3,19.3 v54.3,14.55
CSI_D3  (via drill 0.35)
  Top 0.203: v55.05,15.3 55.3,15.3 56.3,14.3 J1.5 | v55.05,17.8 47.3,17.8 46.8,17.3 U2.33
  Bottom 0.203: v55.05,17.8 v55.05,15.3
CSI_D4  (via drill 0.35)
  Top 0.203: v58.05,14.3 57.8,14.3 57.3,14.8 J1.7 | v58.3,28.55 58.8,29.05 59.55,29.05 U2.5
  Bottom 0.203: v58.05,14.3 58.3,14.55 v58.3,28.55
CSI_D5  (via drill 0.35)
  Top 0.203: v59.05,14.8 58.55,14.8 57.8,15.55 J1.9 | v59.55,27.3 60.55,28.3 U2.4
  Bottom 0.203: v59.05,14.8 59.55,15.3 v59.55,27.3
CSI_D6  (via drill 0.35)
  Top 0.203: v63.3,17.55 61.8,16.05 58.8,16.05 58.55,16.3 J1.11 | v62.3,28.55 60.55,30.3 60.05,30.3 59.8,30.55 59.05,30.55 58.8,30.3 U2.6
  Bottom 0.203: v63.3,17.55 62.3,18.55 v62.3,28.55
CSI_D7  (via drill 0.35)
  Top 0.203: v57.55,17.8 58.55,17.8 59.05,17.3 J1.13 | v57.55,29.3 57.55,30.8 U2.7
  Bottom 0.203: v57.55,29.3 v57.55,17.8
CSI_HSYNC  (via drill 0.35)
  Top 0.203: v54.3,20.3 58.05,20.3 60.05,18.3 J1.16 | v53.55,15.3 52.8,14.55 51.3,14.55 50.55,13.8 U2.37
  Bottom 0.203: v54.3,20.3 53.55,19.55 v53.55,15.3
CSI_MCLK  (via drill 0.35)
  Top 0.203: R1.2 43.05,41.8 43.05,39.55 41.3,39.55 X1.5 | v48.8,17.05 58.55,17.05 58.8,16.8 J1.12 | v47.3,23.3 46.3,24.3 v41.3,24.3 39.55,24.3 39.3,24.05 U2.25
  Bottom 0.203: v48.8,17.05 47.3,18.55 v47.3,23.3 | v41.3,24.3 41.3,39.3 X1.5
CSI_PCLK  (via drill 0.35)
  Top 0.203: v56.55,15.8 56.8,15.8 57.05,15.55 57.3,15.55 J1.8 | v53.05,12.3 52.3,11.55 51.05,11.55 49.3,13.3 49.3,14.3 U2.36 49.55,14.55 v50.55,15.55
  Bottom 0.203: v53.05,12.3 v56.55,15.8 | v50.55,15.55 50.55,16.8 50.8,17.05 C13.1
CSI_VSYNC  (via drill 0.35)
  Top 0.203: v55.55,24.3 60.8,19.05 J1.18 | v54.8,31.8 54.8,33.3 U2.10
  Bottom 0.203: v55.55,24.3 54.8,25.05 v54.8,31.8
GND  (via drill 0.35)
  Top 0.203: 54.05,12.3 53.3,13.05 51.55,13.05 U2.38 | 54.05,12.3 54.3,12.05 v57.3,12.05 59.8,12.05 59.8,15.05 59.3,15.55 58.55,15.55 58.3,15.8 J1.10 | 54.05,12.3 52.8,11.05 51.8,11.05 48.8,8.05 M1.1 | 62.05,21.3 62.3,21.05 J1.23 | 62.05,21.3 62.05,22.05 63.05,22.05 | 63.3,22.05 63.05,22.05 | 63.05,22.05 63.05,21.8 J1.25 | 63.3,22.05 63.3,25.55 U2.1 | 63.3,22.05 J1.26 | v50.05,33.8 48.3,35.55 U2.15 | v61.55,21.3 62.05,21.3 | 60.05,55.8 60.05,53.05 U3.11 60.05,52.8 60.05,49.55 57.3,49.55 56.55,48.8 55.05,48.8 52.55,46.3 | 60.05,55.8 61.8,55.8 61.8,58.55 U3.22 62.05,58.8 62.05,60.55 65.55,60.55 | 60.05,55.8 U3.29 | RN4.4 50.3,68.8 50.8,68.8 RN4.3 51.05,68.8 51.8,68.8 | 51.8,68.8 52.55,68.8 RN4.1 53.3,69.3 56.8,69.3 61.05,65.05 61.05,64.55 C10.2 61.3,64.3 63.05,62.55 65.55,62.55 65.55,60.55 | 51.8,68.8 RN4.2 | 65.55,60.55 R21.2 | 52.55,46.3 56.3,46.3 PAD20.1 | 52.55,46.3 v50.05,46.3 44.3,46.3 42.8,44.8 42.05,44.8 39.3,42.05 39.3,41.55 X1.6 | C14.- 17.8,56.8 19.55,56.8 20.8,58.05 R25.1 21.05,58.3 21.05,61.8 | C12.2 29.05,62.3 28.8,62.05 26.05,62.05 C15.- 25.8,61.8 v24.3,61.8 22.05,61.8 C16.- | 21.05,61.8 21.8,61.8 C16.- | 21.05,61.8 16.8,61.8 C17.- | 21.05,61.8 C16.- | 16.05,21.3 17.8,21.3 C8.2 | 16.05,21.3 15.8,21.3 C9.2 | 20.8,27.3 C7.2 19.05,27.3 13.55,27.3 13.55,22.8 14.05,22.3 14.55,22.3 15.55,21.3 C9.2 | 20.8,27.3 21.8,27.3 C6.2 | 20.8,27.3 20.8,32.55 C1.- 20.8,32.8 20.8,35.05 22.3,36.55 22.3,39.05 22.05,39.3 22.05,42.8 PAD18.1 | 16.05,21.3 28.55,8.8 PAD19.1 | 16.05,21.3 C9.2 | v35.05,53.8 41.3,53.8 PAD17.1
  Bottom 0.203: v61.55,21.3 61.55,14.8 R5.1 61.55,14.55 59.8,14.55 v57.3,12.05 56.8,11.55 52.3,11.55 52.3,15.8 C13.2 52.3,16.05 52.3,22.3 50.8,23.8 IC3.4 50.55,24.05 50.55,30.3 50.05,30.8 v50.05,33.8 v50.05,46.3 | PAD17.1 41.55,53.55 42.8,52.3 52.05,52.3 52.05,45.3 53.05,44.3 58.05,44.3 PAD20.1 | C5.2 12.8,26.55 12.8,25.3 13.3,24.8 2.8.1 13.55,24.8 15.05,24.8 17.3,27.05 1.2.1 17.55,27.05 18.55,27.05 18.55,18.8 17.05,17.3 17.05,14.8 | Q2.2 6.8,23.55 7.55,22.8 7.55,21.55 R3.2 7.8,21.3 14.3,14.8 17.05,14.8 | 19.55,14.8 18.3,14.8 R9.2 18.05,14.8 17.05,14.8 | 19.55,14.8 20.55,14.8 20.8,14.55 20.8,14.05 21.05,13.8 U$1.2 | R28.2 28.55,51.8 28.55,49.8 U$2.P$2 28.8,49.55 28.8,48.8 29.55,48.05 33.55,48.05 | 33.55,48.05 33.55,31.8 32.55,30.8 C3.2 32.3,30.8 30.05,30.8 C4.2 29.8,31.05 27.3,31.05 C11.2 27.05,31.05 24.05,34.05 24.05,36.05 22.8,37.3 22.8,39.8 22.55,40.05 22.55,43.3 | 22.55,66.8 24.55,68.8 IC2.1 | 22.55,66.8 17.3,61.55 17.3,59.8 17.05,59.55 IC1.3 | 22.55,66.8 24.3,65.05 v24.3,61.8 24.3,45.05 22.55,43.3 | 22.55,43.3 22.05,42.8 PAD18.1 22.55,43.3 | 19.55,14.8 19.55,8.3 22.8,5.05 28.55,5.05 28.55,8.55 PAD19.1 | v35.05,53.8 33.55,52.3 33.55,48.05
  pour Bottom (no thermals): 8.8,62.4 7.6,60.6 5,57 3.2,53.2 1.8,48.8 1,44.8 0.4,40.4 0.4,36.2 1,33 1.6,29.4 2.6,25.8 4.2,22.4 6.4,18 9,15.4 11.6,12.8 23,4 29.4,1.4 37,0.6 43.6,0.8 50.6,3.2 54.8,4.8 60,7.6 64.8,12.2 69,17 73,24.2 74.8,31.4 75.6,38.2 75.2,43.2 73.8,49 71.2,56.2 68.4,60.4 65.4,64 61.8,67.6 57.4,70.4 52.8,73.2 42.6,75.8 39.6,75.6 34.2,75.6 29.8,75 23.8,73.4 18.8,70.8 15.2,68.8 11.4,65.4 9.6,63.6
HS2_DATA1  (via drill 0.35)
  Top 0.203: v16.8,24.05 18.8,24.05 19.05,23.8 34.8,23.8 35.8,22.8 39.8,22.8 40.05,23.05 U2.26
  Bottom 0.203: v16.8,24.05 11.8,19.05 R4.1
HS2_DATA2  (via drill 0.35)
  Top 0.203: v61.3,59.8 U3.23 | v53.05,38.8 51.3,37.05 U2.14
  Bottom 0.203: v61.3,59.8 59.3,57.8 59.3,45.8 | 59.3,45.8 60.3,44.8 61.55,44.8 61.55,45.3 61.8,45.55 61.8,46.3 61.55,46.55 61.55,48.05 68.8,55.3 68.8,56.8 67.8,57.8 R35.1 | v53.05,38.8 53.3,39.05 53.3,41.8 54.8,43.3 59.3,43.3 59.3,45.8
HS2_DATA3  (via drill 0.35)
  Top 0.203: v64.05,61.3 60.55,61.3 60.55,58.8 U3.24 | v67.05,59.3 68.3,58.05 69.05,58.05 69.05,46.3 68.05,45.3 67.55,45.3 67.05,45.8 64.05,45.8 63.8,45.55 61.8,45.55 59.55,43.3 57.05,43.3 54.55,40.8 53.8,40.8 49.8,36.8 47.05,36.8 47.05,34.8 U2.16
  Bottom 0.203: v64.05,61.3 65.55,61.3 65.55,60.55 R34.1 65.8,60.55 v67.05,59.3
IO_16  (via drill 0.35)
  Top 0.203: v53.05,22.55 41.55,22.55 41.3,22.3 U2.27
  Bottom 0.203: v53.05,22.55 53.8,23.3 53.8,26.3 53.55,26.55 IC3.1 53.3,26.8 53.3,30.3 53.05,30.55 R6.2
MIC_OP  (via drill 0.35)
  Top 0.203: v32.05,26.8 40.05,26.8 40.3,27.05 U2.24
  Bottom 0.203: U$1.1 22.3,13.55 23.8,12.05 R14.2 24.05,12.05 25.05,11.05 25.05,9.3 24.8,9.05 24.8,5.55 26.55,5.55 26.8,5.8 26.8,8.3 30.05,11.55 30.05,13.05 31.3,14.3 31.3,16.3 30.8,16.8 30.8,25.55 v32.05,26.8
N$1
  Top 0.203: RN1.5 53.3,55.8 52.05,57.05 47.8,57.05 46.3,58.55 46.3,63.05 46.05,63.05 PAD1.1
N$2
  Bottom 0.203: 2.8.3 10.55,23.8 10.8,24.05 10.8,26.55 C5.1 10.8,26.8 10.8,27.8 | 10.8,27.8 10.8,29.05 R2.2 | Q1.3 16.8,30.05 16.8,28.55 14.55,26.3 1.2.3 14.3,26.3 14.3,27.8 10.8,27.8
N$3
  Top 0.203: RN1.6 53.3,55.05 49.05,55.05 45.3,58.8 45.3,59.8 PAD2.1
N$5
  Top 0.203: RN1.7 53.3,54.3 46.05,54.3 43.8,56.55 PAD3.1
N$7
  Top 0.203: RN1.8 53.3,53.3 52.3,52.3 43.8,52.3 41.05,49.55 36.55,49.55 31.8,44.8 31.8,40.55 23.8,40.55 PAD4.1
N$8
  Bottom 0.203: R2.1 12.8,29.3 14.55,29.3 Q1.1 14.8,29.3 15.8,30.3 15.8,31.05 18.05,31.05 19.3,29.8 R11.2
N$9
  Bottom 0.203: Q2.1 8.8,23.55 9.55,22.8 9.55,21.55 R3.1 9.8,21.3 11.55,21.3 R4.2
N$10  (via drill 0.35)
  Top 0.203: v46.3,51.55 53.05,51.55 53.3,51.8 RN2.5 | v42.05,47.3 36.55,41.8 34.8,41.8 29.8,36.8 25.05,36.8 24.05,37.8 PAD5.1
  Bottom 0.203: v42.05,47.3 v46.3,51.55
N$11
  Bottom 0.203: Q2.3 7.55,25.8 7.55,29.05 LED-.1
N$12  (via drill 0.35)
  Top 0.203: v47.3,50.8 53.3,50.8 RN2.6 | v42.05,45.55 37.8,41.3 35.05,41.3 29.3,35.55 22.8,35.55 PAD6.1
  Bottom 0.203: v42.05,45.55 v47.3,50.8
N$13  (via drill 0.35)
  Top 0.203: v62.3,17.55 61.55,17.55 60.55,18.55 J1.17
  Bottom 0.203: v62.3,17.55 62.8,17.05 62.8,16.3 R5.2
N$14  (via drill 0.35)
  Top 0.203: v34.3,46.3 37.05,49.05 38.55,49.05 38.8,48.8 47.3,48.8 48.55,50.05 53.3,50.05 RN2.7
  Bottom 0.203: v34.3,46.3 34.05,46.05 34.05,22.3 PAD7.1
N$15  (via drill 0.35)
  Top 0.203: v49.55,49.05 53.05,49.05 53.3,49.3 RN2.8 | v36.55,23.8 35.8,24.55 v32.05,24.55
  Bottom 0.203: v49.55,49.05 47.55,49.05 47.55,41.8 42.05,36.3 42.05,24.05 41.55,23.55 36.55,23.55 v36.55,23.8 | v32.05,24.55 32.05,19.3 PAD8.1
N$16  (via drill 0.35)
  Top 0.203: v57.8,46.8 58.05,46.8 60.55,49.3 RN3.5
  Bottom 0.203: v57.8,46.8 55.8,44.8 53.3,44.8 53.3,51.8 51.55,53.55 42.55,53.55 42.55,54.05 41.8,54.8 40.3,54.8 40.3,51.3 39.55,50.55 39.55,43.05 34.55,38.05 34.55,23.3 35.3,22.55 35.3,21.8 34.55,21.05 32.8,21.05 32.8,27.05 32.3,27.55 30.3,27.55 30.3,15.8 PAD9.1
N$17
  Top 0.203: PAD10.1 61.55,46.8 61.55,49.3 RN3.6
N$18
  Top 0.203: RN3.7 62.3,49.3 62.3,48.05 63.55,48.05 64.55,47.05 65.3,47.05 PAD11.1
N$19
  Top 0.203: RN3.8 63.05,49.3 64.05,48.3 66.3,48.3 67.8,46.8 PAD12.1
N$20  (via drill 0.35)
  Top 0.203: D3.A 9.8,54.8 11.3,54.8 D2.A 11.55,54.8 13.05,56.3 | 13.05,56.3 13.3,56.55 14.3,56.55 C14.+ | 13.05,56.3 v12.8,56.55
  Bottom 0.203: 14.05,56.55 14.05,59.05 14.3,59.3 IC1.1 | 14.05,56.55 14.05,54.3 14.3,54.05 IC1.8 | v12.8,56.55 14.05,56.55
N$21
  Top 0.203: 54.8,68.55 54.05,68.55 RN5.4 | RN5.1 56.3,68.55 55.8,68.55 RN5.2 55.55,68.55 54.8,68.55 | 54.8,68.55 RN5.3
N$22
  Top 0.203: U3.25 60.05,58.8 60.05,62.3 61.05,62.3 C10.1
N$23  (via drill 0.35)
  Top 0.203: v45.55,9.05 48.55,6.05 M1.2 | v44.8,25.05 44.55,25.3 v29.55,25.3
  Bottom 0.203: 25.55,13.55 24.8,14.3 R10.2 | 25.55,13.55 25.55,6.8 C2.2 | v45.55,9.05 45.3,9.3 45.3,22.8 44.8,23.3 v44.8,25.05 | v29.55,25.3 26.8,22.55 26.8,14.8 25.55,13.55
N$24
  Bottom 0.203: R12.1 21.8,6.8 23.8,6.8 C2.1
N$25
  Bottom 0.203: 21.8,10.3 20.55,11.55 20.55,13.3 20.3,13.55 U$1.3 | 21.8,10.3 23.8,10.3 R14.1 | 21.8,10.3 R12.2
N$26  (via drill 0.35)
  Top 0.203: R15.2 29.3,50.05 v30.55,50.05
  Bottom 0.203: 30.3,50.3 29.8,49.8 U$2.P$3 | 30.3,50.3 30.3,51.8 R28.1 | 30.3,50.3 v30.55,50.05
N$27
  Bottom 0.203: R9.1 20.05,16.55 U$1.4 20.3,16.55 20.3,18.8 R13.1
N$31
  Top 0.203: D2.C 11.55,52.8 12.3,52.05 13.3,52.05 R16.2
N$32
  Bottom 0.203: IC1.4 18.3,59.3 19.55,59.3 19.55,59.05 R24.1
N$33  (via drill 0.35)
  Top 0.203: v17.3,51.05 15.8,49.55 15.3,49.55 R23.1
  Bottom 0.203: v17.3,51.05 17.3,53.55 17.05,53.8 IC1.6
N$34  (via drill 0.35)
  Top 0.203: v16.55,51.8 15.3,51.8 R16.1
  Bottom 0.203: v16.55,51.8 16.05,52.3 16.05,53.55 15.8,53.8 IC1.7
N$35
  Top 0.203: D3.C 9.8,53.05 13.3,49.55 R23.2
N$36  (via drill 0.35)
  Top 0.203: v13.3,54.55 14.8,53.05 16.3,53.05 22.55,46.8 | v25.55,47.05 25.3,46.8 22.55,46.8 | 22.55,46.8 L1.2
  Bottom 0.203: v13.3,54.55 13.3,54.8 12.8,55.3 D1.A | v25.55,47.05 25.55,47.55 27.55,49.55 U$2.P$1
OE
  Top 0.203: U3.20 63.05,57.05 63.3,57.3 64.3,57.3 65.55,58.55 R21.1
PSRAM_CLK  (via drill 0.35)
  Top 0.203: v48.05,21.8 42.55,21.8 42.3,21.55 U2.28
  Bottom 0.203: v48.05,21.8 48.05,28.3 47.8,28.55 IC3.6
PWM0
  Top 0.203: RN1.4 54.8,55.8 55.3,56.3 57.05,56.3 U3.3
PWM1
  Top 0.203: U3.4 56.55,55.8 55.8,55.05 54.8,55.05 RN1.3
PWM2
  Top 0.203: RN1.2 54.8,54.3 55.8,54.3 56.55,55.05 57.05,55.05 U3.5
PWM3
  Top 0.203: RN1.1 54.8,53.55 55.8,53.55 56.8,54.55 57.05,54.55 U3.6
PWM4
  Top 0.203: RN2.4 54.8,51.8 56.8,53.8 57.05,53.8 U3.7
PWM5
  Top 0.203: RN2.3 54.8,51.05 56.3,51.05 58.05,52.8 U3.8
PWM6
  Top 0.203: RN2.2 54.8,50.3 56.55,50.3 58.55,52.3 58.55,52.8 U3.9
PWM7
  Top 0.203: RN2.1 54.8,49.55 56.55,49.55 59.3,52.3 59.3,52.8 U3.10
PWM8
  Top 0.203: RN3.4 60.8,50.8 60.8,52.8 U3.12
PWM9
  Top 0.203: U3.13 61.3,50.8 RN3.3
PWM10
  Top 0.203: RN3.2 62.05,50.8 62.05,52.8 U3.14
PWM11
  Top 0.203: RN3.1 63.05,50.8 63.05,53.8 U3.15
S$1
  Top 0.203: R25.2 26.3,56.8 21.8,56.8 21.05,56.05 R25.3 20.8,55.8 20.3,55.3 16.05,55.3 16.05,57.8 17.3,59.05 R26.1
S$2  (via drill 0.35)
  Top 0.203: v15.05,60.8 15.05,59.3 15.55,59.3 R26.2
  Bottom 0.203: v15.05,60.8 15.05,60.05 15.55,59.55 IC1.2
SD0  (via drill 0.35)
  Top 0.203: v52.05,29.3 43.55,29.3 43.05,29.8 U2.21
  Bottom 0.203: v52.05,29.3 52.05,26.3 52.3,26.05 IC3.2
SD1  (via drill 0.35)
  Top 0.203: v45.8,28.55 42.8,28.55 42.3,29.05 U2.22
  Bottom 0.203: v45.8,28.55 46.55,27.8 IC3.5
SD2  (via drill 0.35)
  Top 0.203: v48.05,32.05 46.55,33.55 U2.17
  Bottom 0.203: v48.05,32.05 48.05,29.8 48.3,29.55 IC3.7
SD3  (via drill 0.35)
  Top 0.203: v51.3,30.05 45.8,30.05 45.8,32.55 U2.18
  Bottom 0.203: v51.3,30.05 51.3,25.3 51.55,25.05 IC3.3
SW+
  Top 0.203: C16.+ 22.05,65.3 23.8,63.55 28.05,63.55 28.3,63.3 30.05,63.3 30.3,63.05 30.3,52.8 22.55,52.8 L1.1 22.3,52.55 20.8,52.55 20.8,50.55 21.3,50.05 23.55,50.05 27.3,46.3 28.05,46.3 30.05,44.3 SW.1
  Bottom 0.203: U$2.P$5 28.8,47.05 29.55,47.05 U$2.P$4 29.8,47.05 30.05,46.8 30.05,44.3 SW.1
TWI_SCK  (via drill 0.35)
  Top 0.203: v55.8,25.3 61.3,19.8 J1.20 | v53.3,36.8 53.3,35.3 U2.12 | v54.05,41.55 53.05,41.55 51.55,43.05 50.3,43.05 49.8,43.55 R7.1
  Bottom 0.203: v55.8,25.3 55.55,25.55 55.55,34.55 53.8,36.3 | v53.3,36.8 53.8,36.3 | v54.05,41.55 53.8,41.3 53.8,36.3
TWI_SDA  (via drill 0.35)
  Top 0.203: J1.22 62.3,20.3 62.55,20.05 62.8,20.05 64.3,21.55 64.3,25.55 64.55,25.8 64.55,30.8 60.3,30.8 57.05,34.05 56.05,34.05 55.3,34.8 54.3,34.8 54.05,34.55 U2.11 53.8,34.3 53.55,34.05 v52.3,34.05 | v51.8,39.8 51.8,41.55 R8.1
  Bottom 0.203: v51.8,39.8 52.3,39.3 v52.3,34.05
U0RXD  (via drill 0.35)
  Top 0.203: v44.55,15.8 47.3,15.8 47.55,16.05 U2.34
  Bottom 0.203: v44.55,15.8 42.3,18.05 42.3,19.3 38.55,23.05 35.8,23.05 35.8,34.3 37.3,35.8 X1.1
U0TXD  (via drill 0.35)
  Top 0.203: v43.8,17.8 43.8,15.55 44.3,15.05 48.3,15.05 48.55,15.3 U2.35 | v44.05,34.3 41.8,36.55 38.55,36.55 37.55,37.55 35.8,37.55 X1.2
  Bottom 0.203: v43.8,17.8 44.05,18.05 v44.05,34.3

### Text on the board
tPlace: PokeBall - V2 | Sanu / Infotech